# Altium schematic sheet USB.SchDoc
size A3
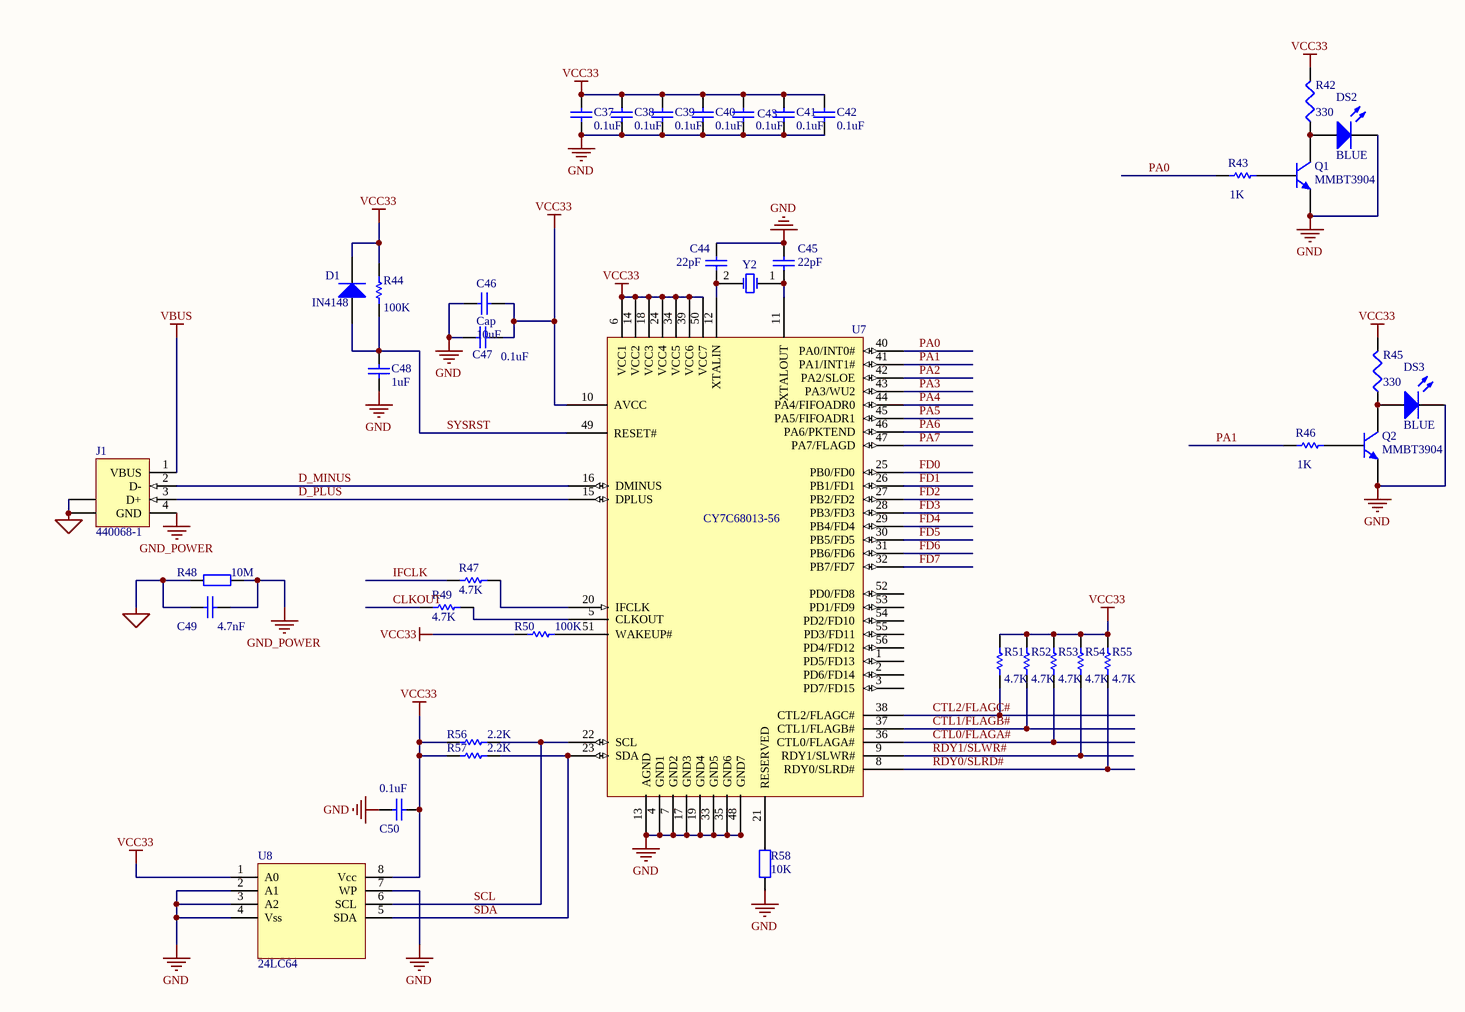
[diagram p0: USB.SchDoc]

## Parts
C37  value 0.1uF  [cc0603]  (hidden comment: Cap Semi)
C38  value 0.1uF  [cc0603]  (hidden comment: Cap Semi)
C39  value 0.1uF  [cc0603]  (hidden comment: Cap Semi)
C40  value 0.1uF  [cc0603]  (hidden comment: Cap Semi)
C41  value 0.1uF  [cc0603]  (hidden comment: Cap Semi)
C42  value 0.1uF  [cc0603]  (hidden comment: Cap Semi)
C43  value 0.1uF  [cc0603]  (hidden comment: Cap Semi)
C44  value 22pF  [cc0603]  (hidden comment: Cap Semi)
C45  value 22pF  [cc0603]  (hidden comment: Cap Semi)
C46  Cap  value 10uF  [cc0603]
C47  value 0.1uF  [cc0603]  (hidden comment: Cap Semi)
C48  value 1uF  [cc0603]  (hidden comment: Cap Semi)
C49  value 4.7nF  [4.7nF]  (hidden comment: Cap)
C50  value 0.1uF  [cc0603]  (hidden comment: Cap Semi)
D1  IN4148  [DIODE]
DS2  BLUE  [HDR1X2]
DS3  BLUE  [HDR1X2]
J1  440068-1  [USB_interface_type_B]
Q1  MMBT3904  [NPN]
Q2  MMBT3904  [NPN]
R42  value 330  [CR0603]
R43  value 1K  [CR0603]
R44  value 100K  [CR0603]  (hidden comment: Res1)
R45  value 330  [CR0603]
R46  value 1K  [CR0603]
R47  value 4.7K  [CR0603]
R48  value 10M  [CR0805]  (hidden comment: Res2)
R49  value 4.7K  [CR0603]
R50  value 100K  [CR0603]  (hidden comment: Res1)
R51  value 4.7K  [CR0603]
R52  value 4.7K  [CR0603]
R53  value 4.7K  [CR0603]
R54  value 4.7K  [CR0603]
R55  value 4.7K  [CR0603]
R56  value 2.2K  [CR0603]  (hidden comment: Res1)
R57  value 2.2K  [CR0603]  (hidden comment: Res1)
R58  value 10K  [CR0603]  (hidden comment: Res2)
U7  CY7C68013-56  [so-56]
U8  24LC64  [sop8]
Y2  XTAL  [USB_jingzhen 24M]  (value not drawn)

## Nets
GND: C37.1 C38.1 C39.1 C40.1 C41.1 C42.1 C43.1 C44.2 C45.1 C46.1 C47.1 C48.1 C50.1 DS2.2(K) DS3.2(K) Q1.1(E) Q2.1(E) R58.1 U7.4(GND1) U7.7(GND2) U7.13(AGND) U7.17(GND3) U7.19(GND4) U7.33(GND5) U7.35(GND6) U7.48(GND7) U8.2(A1) U8.3(A2) U8.4(Vss) U8.7(WP)
GND_POWER: C49.2 J1.4(GND) R48.2
USBSHEILD: C49.1 J1.5(SHLD) J1.6(SHLD) R48.1
VBUS: J1.1(VBUS)
VCC33: C37.2 C38.2 C39.2 C40.2 C41.2 C42.2 C43.2 C46.2 C47.2 C50.2 D1.2(K) R42.2 R44.2 R45.2 R50.2 R51.2 R52.2 R53.2 R54.2 R55.2 R56.1 R57.1 U7.6(VCC1) U7.10(AVCC) U7.14(VCC2) U7.18(VCC3) U7.24(VCC4) U7.34(VCC5) U7.39(VCC6) U7.50(VCC7) U8.1(A0) U8.8(Vcc)
CLKOUT: R49.2
CTL0/FLAGA#: R53.1 U7.36(CTL0/FLAGA#)
CTL1/FLAGB#: R52.1 U7.37(CTL1/FLAGB#)
CTL2/FLAGC#: R51.1 U7.38(CTL2/FLAGC#)
D_MINUS: J1.2(D-) U7.16(DMINUS)
D_PLUS: J1.3(D+) U7.15(DPLUS)
FD0: U7.25(PB0/FD0)
FD1: U7.26(PB1/FD1)
FD2: U7.27(PB2/FD2)
FD3: U7.28(PB3/FD3)
FD4: U7.29(PB4/FD4)
FD5: U7.30(PB5/FD5)
FD6: U7.31(PB6/FD6)
FD7: U7.32(PB7/FD7)
IFCLK: R47.2
PA0: R43.1 U7.40(PA0/INT0#)
PA1: R46.1 U7.41(PA1/INT1#)
PA2: U7.42(PA2/SLOE)
PA3: U7.43(PA3/WU2)
PA4: U7.44(PA4/FIFOADR0)
PA5: U7.45(PA5/FIFOADR1)
PA6: U7.46(PA6/PKTEND)
PA7: U7.47(PA7/FLAGD)
RDY0/SLRD#: R55.1 U7.8(RDY0/SLRD#)
RDY1/SLWR#: R54.1 U7.9(RDY1/SLWR#)
SCL: R56.2 U7.22(SCL) U8.6(SCL)
SDA: R57.2 U7.23(SDA) U8.5(SDA)
SYSRST: C48.2 D1.1(A) R44.1 U7.49(RESET#)
NetC44_1: C44.1 U7.12(XTALIN) Y2.2(OSC2)
NetC45_2: C45.2 U7.11(XTALOUT) Y2.1(OSC1)
NetDS2_1: DS2.1(A) Q1.3(C) R42.1
NetDS3_1: DS3.1(A) Q2.3(C) R45.1
NetQ1_2: Q1.2(B) R43.2
NetQ2_2: Q2.2(B) R46.2
NetR47_1: R47.1 U7.20(IFCLK)
NetR49_1: R49.1 U7.5(CLKOUT)
NetR50_1: R50.1 U7.51(WAKEUP#)
NetR58_2: R58.2 U7.21(RESERVED)

Not connected (* = marked no-connect by the designer): U7 1(PD5/FD13) 2(PD6/FD14) 3(PD7/FD15) 52(PD0/FD8) 53(PD1/FD9) 54(PD2/FD10) 55(PD3/FD11) 56(PD4/FD12)

## Library data of the parts
C37-C45 C47 C48 C50 = Cap Semi: Capacitor (Semiconductor SIM Model); Published: 8-Jun-2000; LatestRevisionDate: 17-Jul-2002; LatestRevisionNote: Re-released for DXP Platform.; PackageReference: C1206; Publisher: Altium Limited
C46 C49 = Cap: Capacitor; Published: 8-Jun-2000; Publisher: Altium Limited
  C46: Revision: July-2002: Re-released for DXP Platform.
  C49: LatestRevisionDate: 17-Jul-2002; LatestRevisionNote: Re-released for DXP Platform.
D1 = Diode 1N4001: 1 Amp General Purpose Rectifier; Published: 8-Jun-2000; LatestRevisionDate: 17-Jul-2002; LatestRevisionNote: Re-released for DXP Platform.; DatasheetDocument: 1998; PackageDocument: Aug-1999; PackageReference: DO-41; Publisher: Altium Limited; Code_JEDEC: DO-204-AL
DS2 DS3 = LED0: Typical INFRARED GaAs LED; Published: 8-Jun-2000; Revision: July-2002: Re-released for DXP Platform.; Publisher: Altium Limited
J1 = 440068-1: USB 1.1, Right Angle, Thru-Hole, Reverse Type, Receptacle, 4 Position, Black; ContactMaterial: Copper Alloy; ContactPlating: Gold Flash; TerminationLength: 2.40mm [0.094in.]; PCB_Layout: Complies with manufacturer's recommendation.; DrillSize: Corresponds to nominal value.; PanelGround: Without; Published: 15-Jul-2004; DatasheetDocument: 18-Mar-2004; PackageDocument: 18-Mar-2004; PackageReference: 440068; Publisher: Altium Limited; HousingMaterial: Glass-Filled Thermoplastic
Q1 Q2 = 2N3904: NPN General Purpose Amplifier; Revision 1: 11-Jul-2000: SIM Model Added.; Revision 2: 17-Jul-2002: Re-released for DXP Platform.; Revision 3: 15-Jan-2003: PCB Footprint 'BCY-W3/D4.7' replaced; Code - JEDEC: TO-92A; Published: 8-Jun-2000; Datasheet: Latest Revision: 1997; Package Reference: TO-92A; Publisher: Altium Limited
R42 R45 = Res3: Resistor; Published: 8-Jun-2000; Revision: July-2002: Re-released for DXP Platform.; Publisher: Altium Limited
R43 R44 R46 R47 R49-R57 = Res1: Resistor; Published: 8-Jun-2000; Publisher: Altium Limited
  R43 R46 R47 R49 R51-R55: Revision: July-2002: Re-released for DXP Platform.
  R44 R50 R56 R57: LatestRevisionDate: 17-Jul-2002; LatestRevisionNote: Re-released for DXP Platform.
R48 R58 = Res2: Resistor; Published: 8-Jun-2000; LatestRevisionDate: 17-Jul-2002; LatestRevisionNote: Re-released for DXP Platform.; Publisher: Altium Limited
U8 = EPCS1SI8: EPCS1 Series, In-system programmable 3.3V configuration device, 8-Pin SOIC, 1-Megabit, Industrial Grade; PackageDocument: ver11.0, Feb-2003; Configures: Cyclone FPGAs; Published: 17-Sep-2003; DatasheetDocument: ver1.1, Oct-2003; PackageReference: SOIC8; Publisher: Altium Limited; Code_JEDEC: MS-012-AA; Code_IPC: SO8
Y2 = XTAL: Crystal Oscillator; Published: 8-Jun-2000; LatestRevisionDate: 17-Jul-2002; LatestRevisionNote: Re-released for DXP Platform.; Publisher: Altium Limited